# Altium schematic sheet 14-Counter74LS192.SchDoc
size A4; DocumentNumber: 14; SheetNumber: 14; SheetTotal: 26
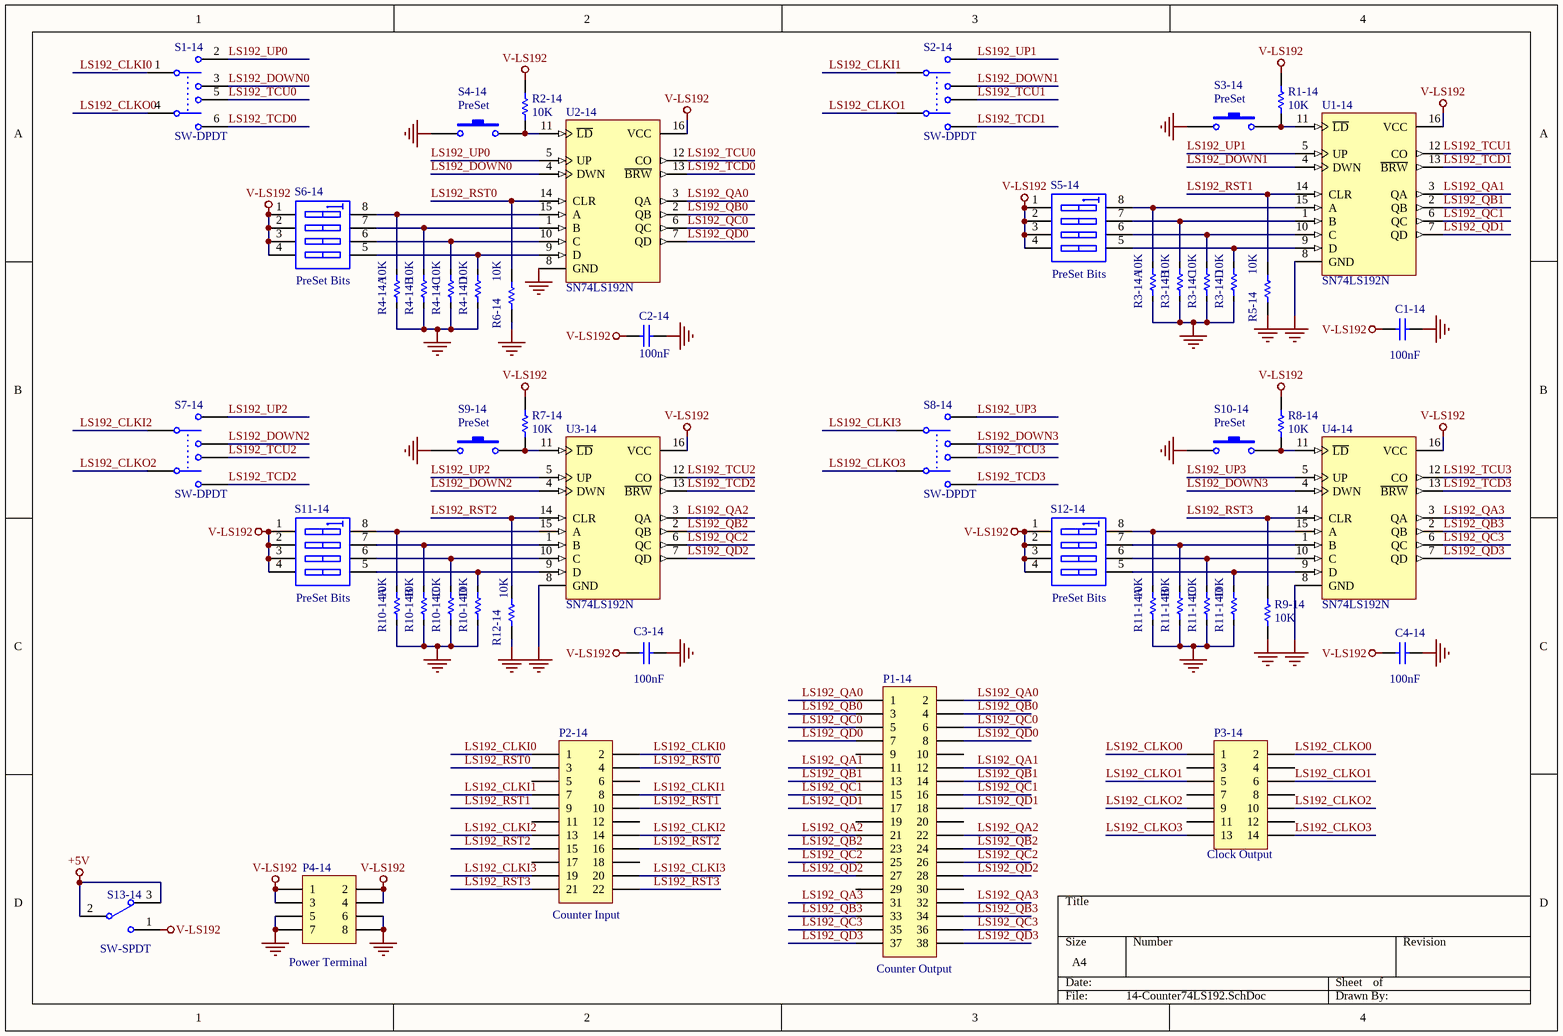
[diagram p0: 14-Counter74LS192.SchDoc]

## Parts
C1-14  value 100nF  [c-0805]  (hidden comment: 104)
C2-14  value 100nF  [c-0805]  (hidden comment: 104)
C3-14  value 100nF  [c-0805]  (hidden comment: 104)
C4-14  value 100nF  [c-0805]  (hidden comment: 104)
P1-14  value Counter Output  [JP2.54-F-2x19A]  (hidden comment: Header 19X2)
P2-14  value Counter Input  [JP2.54-F-2x11A]  (hidden comment: Header 11X2)
P3-14  value Clock Output  [JP2.54-F-2x07A]  (hidden comment: Header 7X2)
P4-14  Publisher: Power Terminal  [JP2.54-F-2x04A]  (hidden comment: Header 4X2)
R1-14  10K  [R-0805]
R2-14  10K  [R-0805]
R3-14  10K  [R-Array-0603-4]  (parts A,B,C,D of 4)
R4-14  10K  [R-Array-0603-4]  (parts A,B,C,D of 4)
R5-14  10K  [R-0805]
R6-14  10K  [R-0805]
R7-14  10K  [R-0805]
R8-14  10K  [R-0805]
R9-14  10K  [R-0805]
R10-14  10K  [R-Array-0603-4]  (parts A,B,C,D of 4)
R11-14  10K  [R-Array-0603-4]  (parts A,B,C,D of 4)
R12-14  10K  [R-0805]
S1-14  SW-DPDT  [DPDT-6]
S2-14  SW-DPDT  [DPDT-6]
S3-14  value PreSet  [SW-T-S6-SMD]  (hidden comment: SW-S6)
S4-14  value PreSet  [SW-T-S6-SMD]  (hidden comment: SW-S6)
S5-14  value PreSet Bits  [SW-DIP4-SMD]  (hidden comment: SW DIP-4)
S6-14  value PreSet Bits  [SW-DIP4-SMD]  (hidden comment: SW DIP-4)
S7-14  SW-DPDT  [DPDT-6]
S8-14  SW-DPDT  [DPDT-6]
S9-14  value PreSet  [SW-T-S6-SMD]  (hidden comment: SW-S6)
S10-14  value PreSet  [SW-T-S6-SMD]  (hidden comment: SW-S6)
S11-14  value PreSet Bits  [SW-DIP4-SMD]  (hidden comment: SW DIP-4)
S12-14  value PreSet Bits  [SW-DIP4-SMD]  (hidden comment: SW DIP-4)
S13-14  SW-SPDT  [SW-SLIDE-2P-2W]
U1-14  SN74LS192N  [SK-DIP16-300]
U2-14  SN74LS192N  [SK-DIP16-300]
U3-14  SN74LS192N  [SK-DIP16-300]
U4-14  SN74LS192N  [SK-DIP16-300]

## Nets
+5V: S13-14.2 S13-14.3
GND: C1-14.2 C2-14.2 C3-14.2 C4-14.2 P4-14.5 P4-14.6 P4-14.7 P4-14.8 R3-14.1 R3-14.3 R3-14.5 R3-14.7 R4-14.1 R4-14.3 R4-14.5 R4-14.7 R5-14.1 R6-14.1 R9-14.1 R10-14.1 R10-14.3 R10-14.5 R10-14.7 R11-14.1 R11-14.3 R11-14.5 R11-14.7 R12-14.1 S3-14.1 S4-14.1 S9-14.1 S10-14.1 U1-14.8(GND) U2-14.8(GND) U3-14.8(GND) U4-14.8(GND)
V-LS192: C1-14.1 C2-14.1 C3-14.1 C4-14.1 P4-14.1 P4-14.2 P4-14.3 P4-14.4 R1-14.2 R2-14.2 R7-14.2 R8-14.2 S5-14.1(A1) S5-14.2(A2) S5-14.3(A3) S5-14.4(A4) S6-14.1(A1) S6-14.2(A2) S6-14.3(A3) S6-14.4(A4) S11-14.1(A1) S11-14.2(A2) S11-14.3(A3) S11-14.4(A4) S12-14.1(A1) S12-14.2(A2) S12-14.3(A3) S12-14.4(A4) S13-14.1 U1-14.16(VCC) U2-14.16(VCC) U3-14.16(VCC) U4-14.16(VCC)
LS192_CLKI0: P2-14.1 P2-14.2 S1-14.1
LS192_CLKI1: P2-14.7 P2-14.8 S2-14.1
LS192_CLKI2: P2-14.13 P2-14.14 S7-14.1
LS192_CLKI3: P2-14.19 P2-14.20 S8-14.1
LS192_CLKO0: P3-14.1 P3-14.2 S1-14.4
LS192_CLKO1: P3-14.5 P3-14.6 S2-14.4
LS192_CLKO2: P3-14.9 P3-14.10 S7-14.4
LS192_CLKO3: P3-14.13 P3-14.14 S8-14.4
LS192_DOWN0: S1-14.3 U2-14.4(DWN)
LS192_DOWN1: S2-14.3 U1-14.4(DWN)
LS192_DOWN2: S7-14.3 U3-14.4(DWN)
LS192_DOWN3: S8-14.3 U4-14.4(DWN)
LS192_QA0: P1-14.1 P1-14.2 U2-14.3(QA)
LS192_QA1: P1-14.11 P1-14.12 U1-14.3(QA)
LS192_QA2: P1-14.21 P1-14.22 U3-14.3(QA)
LS192_QA3: P1-14.31 P1-14.32 U4-14.3(QA)
LS192_QB0: P1-14.3 P1-14.4 U2-14.2(QB)
LS192_QB1: P1-14.13 P1-14.14 U1-14.2(QB)
LS192_QB2: P1-14.23 P1-14.24 U3-14.2(QB)
LS192_QB3: P1-14.33 P1-14.34 U4-14.2(QB)
LS192_QC0: P1-14.5 P1-14.6 U2-14.6(QC)
LS192_QC1: P1-14.15 P1-14.16 U1-14.6(QC)
LS192_QC2: P1-14.25 P1-14.26 U3-14.6(QC)
LS192_QC3: P1-14.35 P1-14.36 U4-14.6(QC)
LS192_QD0: P1-14.7 P1-14.8 U2-14.7(QD)
LS192_QD1: P1-14.17 P1-14.18 U1-14.7(QD)
LS192_QD2: P1-14.27 P1-14.28 U3-14.7(QD)
LS192_QD3: P1-14.37 P1-14.38 U4-14.7(QD)
LS192_RST0: P2-14.3 P2-14.4 R6-14.2 U2-14.14(CLR)
LS192_RST1: P2-14.9 P2-14.10 R5-14.2 U1-14.14(CLR)
LS192_RST2: P2-14.15 P2-14.16 R12-14.2 U3-14.14(CLR)
LS192_RST3: P2-14.21 P2-14.22 R9-14.2 U4-14.14(CLR)
LS192_TCD0: S1-14.6 U2-14.13(~{BRW})
LS192_TCD1: S2-14.6 U1-14.13(~{BRW})
LS192_TCD2: S7-14.6 U3-14.13(~{BRW})
LS192_TCD3: S8-14.6 U4-14.13(~{BRW})
LS192_TCU0: S1-14.5 U2-14.12(CO)
LS192_TCU1: S2-14.5 U1-14.12(CO)
LS192_TCU2: S7-14.5 U3-14.12(CO)
LS192_TCU3: S8-14.5 U4-14.12(CO)
LS192_UP0: S1-14.2 U2-14.5(UP)
LS192_UP1: S2-14.2 U1-14.5(UP)
LS192_UP2: S7-14.2 U3-14.5(UP)
LS192_UP3: S8-14.2 U4-14.5(UP)
NetR1-14_1: R1-14.1 S3-14.2 U1-14.11(~{LD})
NetR2-14_1: R2-14.1 S4-14.2 U2-14.11(~{LD})
NetR3-14_2: R3-14.2 S5-14.8(B1) U1-14.15(A)
NetR3-14_4: R3-14.4 S5-14.7(B2) U1-14.1(B)
NetR3-14_6: R3-14.6 S5-14.6(B3) U1-14.10(C)
NetR3-14_8: R3-14.8 S5-14.5(B4) U1-14.9(D)
NetR4-14_2: R4-14.2 S6-14.8(B1) U2-14.15(A)
NetR4-14_4: R4-14.4 S6-14.7(B2) U2-14.1(B)
NetR4-14_6: R4-14.6 S6-14.6(B3) U2-14.10(C)
NetR4-14_8: R4-14.8 S6-14.5(B4) U2-14.9(D)
NetR7-14_1: R7-14.1 S9-14.2 U3-14.11(~{LD})
NetR8-14_1: R8-14.1 S10-14.2 U4-14.11(~{LD})
NetR10-14_2: R10-14.2 S11-14.8(B1) U3-14.15(A)
NetR10-14_4: R10-14.4 S11-14.7(B2) U3-14.1(B)
NetR10-14_6: R10-14.6 S11-14.6(B3) U3-14.10(C)
NetR10-14_8: R10-14.8 S11-14.5(B4) U3-14.9(D)
NetR11-14_2: R11-14.2 S12-14.8(B1) U4-14.15(A)
NetR11-14_4: R11-14.4 S12-14.7(B2) U4-14.1(B)
NetR11-14_6: R11-14.6 S12-14.6(B3) U4-14.10(C)
NetR11-14_8: R11-14.8 S12-14.5(B4) U4-14.9(D)

Not connected (* = marked no-connect by the designer): P1-14 9 10 19 20 29 30; P2-14 5 6 11 12 17 18; P3-14 3 4 7 8 11 12

## Library data of the parts
C1-14 C2-14 C3-14 C4-14 = Cap: Capacitor; Published: 8-Jun-2000; LatestRevisionDate: 17-Jul-2002; LatestRevisionNote: Re-released for DXP Platform.; PackageReference: RAD-0.3; Publisher: Altium Limited; PackageDescription: Radial Cap, Thru-Hole; 2 Leads; 0.3 in Pin Spacing
P1-14 = Header 19X2: Header, 19-Pin, Dual row; LatestRevisionDate: 17-Jul-2002; LatestRevisionNote: Re-released for DXP Platform.
P2-14 = Header 11X2: Header, 11-Pin, Dual row; LatestRevisionDate: 17-Jul-2002; LatestRevisionNote: Re-released for DXP Platform.
P3-14 = Header 7X2: Header, 7-Pin, Dual row; LatestRevisionDate: 17-Jul-2002; LatestRevisionNote: Re-released for DXP Platform.
P4-14 = Header 4X2: Header, 4-Pin, Dual row; LatestRevisionDate: 17-Jul-2002; LatestRevisionNote: Re-released for DXP Platform.
R1-14 R2-14 R5-14 R6-14 R7-14 R8-14 R9-14 R12-14 = Res1: Resistor; Published: 8-Jun-2000; LatestRevisionDate: 17-Jul-2002; LatestRevisionNote: Re-released for DXP Platform.; PackageReference: AXIAL-0.3; Publisher: Altium Limited; PackageDescription: Axial Device, Thru-Hole; 2 Leads; 0.3 in Pin Spacing; Value: 10K
R3-14 R4-14 R10-14 R11-14 = R-8P4R: RES ARRAY 4 RES 330 OHM 1206; Manufacturer: Panasonic Electronic Components; Manufacturer Part Number: EXB-38V331JV; Digi-Key Part Number: Y9331TR-ND; Link: http://www.digikey.com/product-detail/en/EXB-38V331JV/Y9331TR-ND/256525
S1-14 S2-14 S7-14 S8-14 = SW-DPDT: Double-Pole, Double-Throw Switch; Published: 24-Mar-1999; LatestRevisionDate: 17-Jul-2002; LatestRevisionNote: Re-released for DXP Platform.; PackageReference: DPDT-6; Publisher: Altium Limited
S3-14 S4-14 S9-14 S10-14 = SW-PB: Switch; Published: 24-Mar-1999; LatestRevisionDate: 17-Jul-2002; LatestRevisionNote: Re-released for DXP Platform.; PackageReference: SPST-2
S5-14 S6-14 S11-14 S12-14 = SW DIP-4: DIP Switch, 4 Position, SPST; Published: 24-Mar-1999; LatestRevisionDate: 29-May-2009; LatestRevisionNote: IPC-7351 Footprint Added.; PackageVersion: Dec-2002; PackageReference: SO8; PackageDescription: 8-Pin Small Outline Integrated Circuit 1.27 mm Pitch; Code_JEDEC: MS-012-AA; Code_IPC: SOIC127P600-8
S13-14 = SW-SPDT: SPDT Subminiature Toggle Switch, Right Angle Mounting, Vertical Actuation; Published: 24-Mar-1999; LatestRevisionDate: 17-Dec-2003; LatestRevisionNote: Schematic revised, PCB Footprint replaced.; DatasheetVersion: 05-Dec-2000; PackageReference: TL36WW15050; Publisher: Altium Limited; PackageDescription: Switch; 4 Leads; ComponentLink1Description: Manufacturer Link; ComponentLink1URL: http://www.apem.com
U1-14 U2-14 U3-14 U4-14 = SN74LS192N: Synchronous 4-Bit Up/Down Counter (Dual Clock with Clear); ComponentAvailability: Obsolete; Published: 8-Jun-2000; LatestRevisionDate: 04-Mar-2005; LatestRevisionNote: Stylized 3D Model Added.; DatasheetVersion: Mar-1988; PackageVersion: Oct-1995; PackageReference: N016D; Publisher: Altium Limited; PackageDescription: DIP; 16 Leads; Row Spacing 7.62 mm; Pitch 2.54 mm; Code_JEDEC: MS-001-BB; ComponentLink1Description: Manufacturer Link; ComponentLink1URL: http://www.ti.com/; ComponentLink2Description: Datasheet; ComponentLink2URL: http://www-s.ti.com/sc/ds/sn74ls192.pdf